# Altium schematic sheet Schematic.SchDoc
size A4
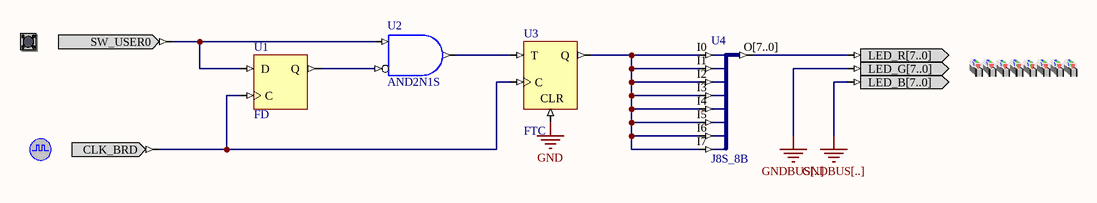
[diagram p0: Schematic.SchDoc]

## Parts
(Parts that share a designator on the sheet are numbered #1, #2 ... from top to bottom, then left to right.)
?#1  USER_BUTTON0  (value not drawn)
?#2  LEDS_RGB  (value not drawn)
?#3  CLOCK_BOARD  (value not drawn)
U1  FD
U2  AND2N1S
U3  FTC
U4  J8S_8B

## Nets
GND: U3.CLR
GNDBUS[..]: ?#2.LED_B[7..0] ?#2.LED_G[7..0]
Net?#1_SW_USER0: ?#1.SW_USER0 U1.D U2.I1
Net?#2_LED_R[7..0]: ?#2.LED_R[7..0] U4.O[7..0]
Net?#3_CLK_BRD: ?#3.CLK_BRD U1.C U3.C
NetU1_Q: U1.Q U2.I0
NetU2_O: U2.O U3.T
NetU3_Q: U3.Q U4.I0 U4.I1 U4.I2 U4.I3 U4.I4 U4.I5 U4.I6 U4.I7

## Library data of the parts
?#1 = USER_BUTTON0: Generic User Button; PortComponent: True; Published: 16-Apr-2007; Publisher: Altium Limited; HelpURL: https://wiki.altium.com/display/ADOH/NanoBoard+3000+-+Generic+User+Switches
?#2 = LEDS_RGB: LEDS RGB; PortComponent: True; Published: 11-Mar-2009; Publisher: Altium Limited; HelpURL: https://wiki.altium.com/display/ADOH/NanoBoard+3000+-+RGB+User+LEDs
?#3 = CLOCK_BOARD: Global System Clock Supply; PortComponent: True; Published: 19-Nov-2003; Publisher: Altium Limited; HelpURL: https://wiki.altium.com/display/ADOH/NanoBoard+3000+-+System+Clocks; UseInDSF: True
U1 = FD: D-Type Flip-Flop; ClockTrigger: Rising; ArchiveName: GENERIC; VHDLIB_SIM: GENERIC_LIB; Published: 29-Jan-2004; Publisher: Altium Limited; XilinxEquivalent: FD; LastRevisionNo: 1.00.00; HelpURL: CR0118 FPGA Generic Library Guide.pdf#page=170; ComponentLink1URL: CR0133 FPGA Flip Flop Resource Usage.pdf#page=4; ComponentLink1Description: Core &Resource Usage; FunctionalClass: Flip-Flop; SubClass: FD
U2 = AND2N1S: 2-Input AND Gate with Active Low A Input, Single Pin Version; XilinxEquivalent: AND2B1; FunctionalClass: Logic Primitive; PortSize: 2; ArchiveName: GENERIC; VHDLIB_SIM: GENERIC_LIB; Published: 29-Jan-2004; Publisher: Altium Limited; LastRevisionNo: 1.00.00; HelpURL: CR0118 FPGA Generic Library Guide.pdf#page=114; ComponentLink1URL: CR0136 FPGA Logic Primitive Resource Usage.pdf#page=10; ComponentLink1Description: Core &Resource Usage; SubClass: AND; PortStyle: Single Pin Version
U3 = FTC: Toggle Flip-Flop with Toggle Enable and Asynchronous Clear; SubClass: T; ClockTrigger: Rising; Enable: High; ArchiveName: GENERIC; VHDLIB_SIM: GENERIC_LIB; Published: 29-Jan-2004; Publisher: Altium Limited; XilinxEquivalent: FTC; LastRevisionNo: 1.00.00; HelpURL: CR0118 FPGA Generic Library Guide.pdf#page=252; ComponentLink1URL: CR0133 FPGA Flip Flop Resource Usage.pdf#page=220; ComponentLink1Description: Core &Resource Usage; FunctionalClass: Flip-Flop; Reset: Asynchronous
U4 = J8S_8B: 8 Single pin inputs to single 8-Bit output bus; FunctionalClass: Bus Joiner; PortSize: 8; ArchiveName: GENERIC; VHDLIB_SIM: GENERIC_LIB; Published: 29-Jan-2004; Publisher: Altium Limited; LastRevisionNo: 1.00.00; HelpURL: CR0118 FPGA Generic Library Guide.pdf#page=306; ComponentLink1URL: CR0126 FPGA Bus Joiner Resource Usage.pdf#page=28; ComponentLink1Description: Core &Resource Usage